# EAGLE design hf-upconverter (EAGLE 7.4.0)
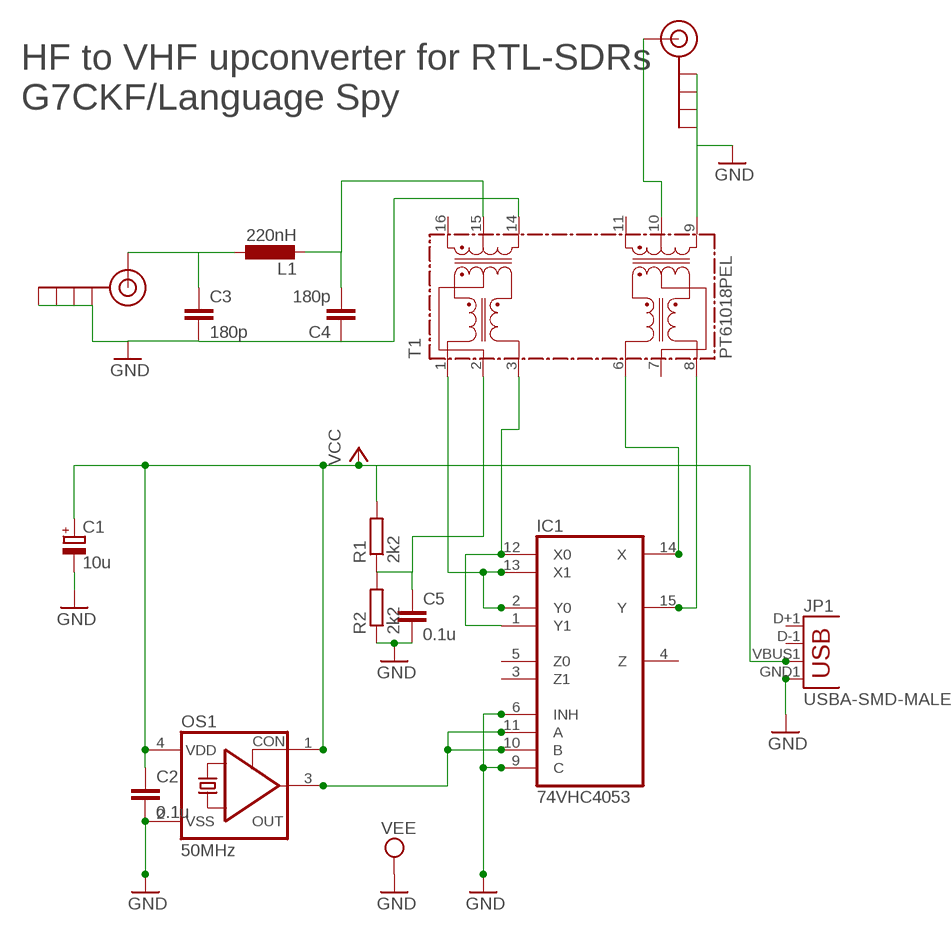
[diagram p0: schematic, sheet 1]

## Parts
C1  10u  CPOL-EUB  [PANASONIC_B]
C2  0.1u  C-EUC0805  [C0805]
C3  180p  C-EUC0805  [C0805]
C4  180p  C-EUC0805  [C0805]
C5  0.1u  C-EUC0805  [C0805]
IC1  74VHC4053  4053D  [SO16]
JP1  USBA-SMD-MALE  [USB-A-SMT-MALE]
L1  220nH  L-EU  [R1206]
OS1  50MHz  OSC-OE-CFPS-32  [7.2X5.2-4-PAD]
R1  2k2  R-EU_R0805  [R0805]
R2  2k2  R-EU_R0805  [R0805]
SMA1  ANT  SMA_EDGE  [SMA-EDGE]
SMA2  OUT  SMA_EDGE  [SMA-EDGE]
T1  PT61018PEL  TG110-E050N5  [N5]

## Nets
GND: C1.- C2.2 C3.2 C4.1 C5.2 IC1.6(INH) IC1.9(C) JP1.GND1(GND) OS1.2(VSS) R2.1 SMA1.GND@0(GND) SMA1.GND@1(GND) SMA1.GND@2(GND) SMA1.GND@3(GND) SMA2.GND@0(GND) SMA2.GND@1(GND) SMA2.GND@2(GND) SMA2.GND@3(GND) T1.9 T1.14 ; supply symbol labelled VEE
N$1: IC1.10(B) IC1.11(A) OS1.3(OUT)
N$2: C5.1 R1.1 R2.2 T1.2
N$3: IC1.1(Y1) IC1.12(X0) T1.3
N$4: IC1.2(Y0) IC1.13(X1) T1.1
N$5: C3.1 L1.1 SMA1.SIG(SIGNAL)
N$8: IC1.14(X) T1.6
N$9: IC1.15(Y) T1.8
N$10: C4.2 L1.2 T1.15
N$14: SMA2.SIG(SIGNAL) T1.10
VCC: C1.+ C2.1 JP1.VBUS1(VBUS) OS1.1(CON) OS1.4(VDD) R1.2
Unconnected: IC1.3(Z1) IC1.4(Z) IC1.5(Z0) JP1.D+1(D+) JP1.D-1(D-) T1.7 T1.11 T1.16

## Notes on the sheet
- HF to VHF upconverter for RTL-SDRs
  G7CKF/Language Spy

## Power pins joined to a net without a drawn wire
GND: IC1.7(VEE) IC1.8(GND)
VCC: IC1.16(VCC)

## Library data of the parts
C1 = rcl:CPOL-EU: POLARIZED CAPACITOR, European symbol
C2-C5 = rcl:C-EU: CAPACITOR, European symbol
IC1 = 40xx:4053: Triple 2-channel ANALOG MULTIPLEXER
JP1 = SparkFun-Connectors:USB: USB Connectors USB-B-PTH is fully proven SKU : PRT-00139/CONN-08278 USB-miniB is fully proven SKU : PRT-00587 USB-A-PCB is untested. USB-A-H is throughly reviewed, but untested. Spark Fun Electronics SKU : PRT-00437 USB-B-SMT is throughly reviewed, but untested. Needs silkscreen touching up. USB-A-S has not been used/tested USB-MB-H has not been used/tested USB-MICROB has been used. CONN-09505
L1 = L1206:L-EU: INDUCTOR, European symbol
OS1 = IQD-Frequency-Products:OSC-OE: OSCILLATOR WITH OE
R1 R2 = rcl:R-EU_: RESISTOR, European symbol
SMA1 SMA2 = SparkFun-Connectors:SMA_EDGE: SMA Antenna Connector End launch SMA connector. The paste layer has been removed so that the connector can be hand soldered onto the board after reflow.
T1 = halo-electronics:TG110-E050N5: E-Ultra (TM) 10/100BASE-TX SOIC-16 Fast Ethernet Magnetic Modules Source: www.haloelectronics.com .. e-ultra.pdf

## Board
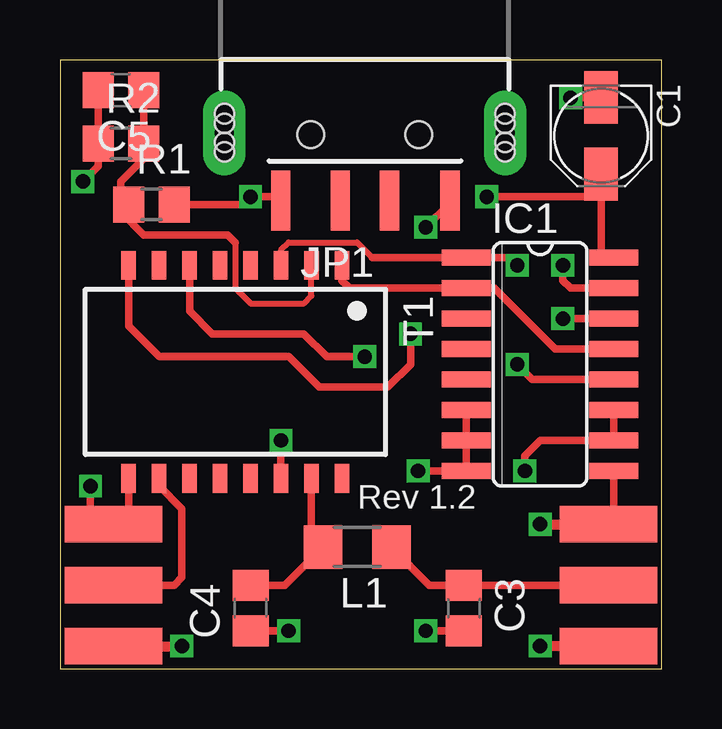
[diagram p1: board, top side]
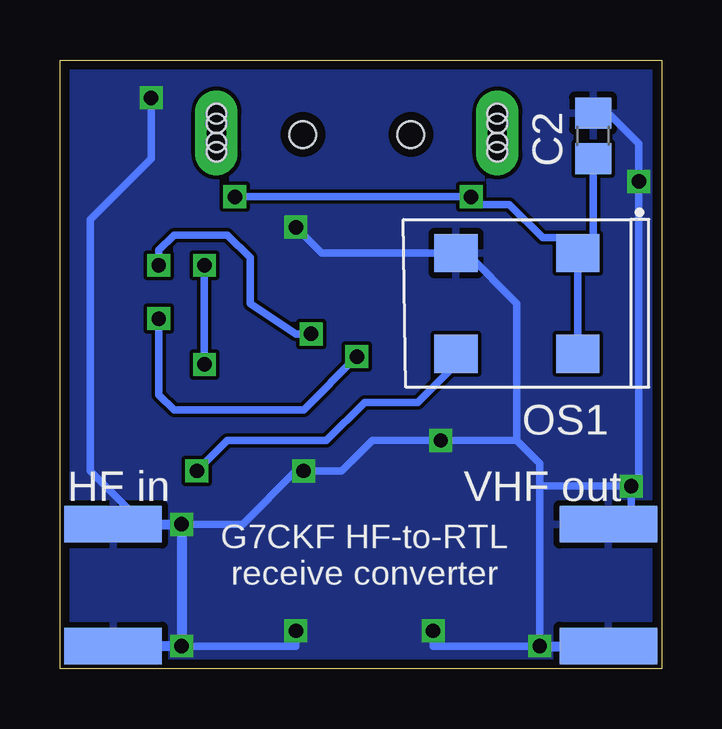
[diagram p2: board, bottom side, seen from below]

Size 25.07 x 25.39 mm. Coordinates in mm from the lower left corner, seen from the top.
Outline: 0,0 25.07,0 25.07,25.39 0,25.39 0,0
Copper layers (1*16): Top 0.0356mm / dielectric 1.5011mm / Bottom 0.0356mm
Design rules "LaenPCBOrder": minimum track width 6mil, minimum drill 13mil, track to track 6mil, track to pad 6mil, pad to pad 6mil, via to via 6mil, smd to smd 6mil, copper to edge 15mil, drill to drill 6mil, minimum pad ring 7mil, minimum via ring 7mil, stop-mask expansion 3mil, vias tented up to drill 0mil, thermal gap 10mil

### Footprints (pad centres in the part's own frame; a part is rotated, then mirrored left to right if it is on the bottom)
PANASONIC_B = smd 2.2 x 1.4: + 1.6,0; - -1.6,0
C0805 = smd 1.3 x 1.5: 1 -0.95,0; 2 0.95,0
SO16 = smd 0.66 x 2.032: 1 -4.445,-3.073; 2 -3.175,-3.073; 3 -1.905,-3.073; 4 -0.635,-3.073; 5 0.635,-3.073; 6 1.905,-3.073; 7 3.175,-3.073; 8 4.445,-3.073; 9 4.445,3.073; 10 3.175,3.073; 11 1.905,3.073; 12 0.635,3.073; 13 -0.635,3.073; 14 -1.905,3.073; 15 -3.175,3.073; 16 -4.445,3.073
USB-A-SMT-MALE = smd 0.8 x 2.5: D+1 1.027,-5.87; D-1 -1.027,-5.87; GND1 3.551,-5.87; VBUS1 -3.5,-5.87 | drill 0.8 pad 1.778 long: P$1 5.85,-3.05; P$3 -5.85,-3.05 | hole 1.1: 2.25,-3.12; -2.25,-3.12 | hole 0.8: -5.85,-3.45; -5.85,-3.85; -5.85,-2.65; -5.85,-2.25; 5.85,-3.45; 5.85,-3.85; 5.85,-2.65; 5.85,-2.25
R1206 = smd 1.6 x 1.803: 1 -1.422,0; 2 1.422,0
7.2X5.2-4-PAD = smd 1.8 x 1.6: 1 -2.54,-2.1; 2 2.54,-2.1; 3 2.54,2.1; 4 -2.54,2.1
R0805 = smd 1.3 x 1.5: 1 -0.95,0; 2 0.95,0
SMA-EDGE = smd 1.524 x 4.064: GND@0 0,0; GND@1 5.08,0; SIG 2.54,0 | smd 1.524 x 4.064 bottom: GND@2 0,0; GND@3 5.08,0
N5 = smd 0.6 x 1.2: 1 -4.445,-4.445; 2 -3.175,-4.445; 3 -1.905,-4.445; 4 -0.635,-4.445; 5 0.635,-4.445; 6 1.905,-4.445; 7 3.175,-4.445; 8 4.445,-4.445; 9 4.445,4.445; 10 3.175,4.445; 11 1.905,4.445; 12 0.635,4.445; 13 -0.635,4.445; 14 -1.905,4.445; 15 -3.175,4.445; 16 -4.445,4.445

### Placement (x,y rotation side)
C1  22.54,22.23 270 top
C2  2.86,22.23 90 bottom
C3  16.83,2.54 270 top
C4  7.94,2.54 90 top
C5  2.54,24.13 180 top
IC1  20,12.7 270 top
JP1  12.7,25.4 0 top
L1  12.38,5.08 180 top
OS1  6.03,15.24 180 bottom
R1  3.81,19.37 0 top
R2  2.54,21.91 0 top
SMA1  22.86,0.95 90 top
SMA2  2.22,0.95 90 top
T1  7.3,12.38 180 top

### Tracks (layer width: path | path; a pad name or v marks a point on that pad's centre or on a via)
GND  (via drill 0.6)
  Top 0.305: IC1.6 IC1.7 IC1.8 v14.92,8.26 | SMA1.GND@1 23.08,6.03 IC1.9 | T1.14 v9.21,9.53 | v1.27,7.62 1.27,6.03 SMA2.GND@3 2.86,6.67 T1.9 | C4.1 v9.52,1.59 v9.53,1.59 | C3.2 v15.24,1.59 | JP1.GND1 16.25,19.43 v15.24,18.41 | v21.27,23.81 22.53,23.81 C1.- | v0.95,20.32 1.59,20.96 R2.1 C5.2
  Top 0.406: SMA2.GND@2 v5.08,0.95 | v20,6.03 SMA1.GND@1 | SMA1.GND@2 v20,0.95
  Bottom 0.305: v20,6.03 17.46,6.03 15.24,8.26 v14.92,8.26 13.34,8.26 12.06,9.53 v9.21,9.53 6.03,9.53 | v1.27,7.62 5.08,7.62 | 5.08,7.62 v5.08,0.95 9.53,0.95 v9.53,1.59 | v1.27,7.62 1.27,6.03 SMA2.GND@3 | 5.08,7.62 5.08,8.57 6.03,9.53 | v15.24,1.59 15.24,0.95 v20,0.95 | v15.24,18.41 14.16,17.34 OS1.2 8.13,17.34 6.03,15.24 6.03,9.53 | v21.27,23.81 21.27,21.27 23.81,18.73 23.81,8.26 21.59,6.03 | C2.2 2.22,23.18 0.95,21.91 v0.95,20.32 0.95,7.94 v1.27,7.62
  Bottom 0.406: v5.08,0.95 SMA2.GND@2 | SMA1.GND@1 21.59,6.03 v20,6.03 v20,0.95 SMA1.GND@2
  pour Bottom: 0,25.4 25.08,25.4 25.08,0 0,0
N$1  (via drill 0.6)
  Top 0.305: IC1.11 IC1.10 20,9.53 19.37,8.89 v19.37,8.26
  Bottom 0.305: OS1.3 8.26,13.02 10.16,11.11 12.38,11.11 13.97,9.53 18.1,9.53 v19.37,8.26
N$2
  Top 0.254: 7.3,17.78 7.3,15.88 7.94,15.24 10.16,15.24 10.48,15.56 T1.2
  Top 0.305: 7.3,17.78 6.99,18.1 3.49,18.1 2.54,19.05 R1.1 2.54,19.37 2.54,20.32 3.49,21.27 R2.2 C5.1
N$3  (via drill 0.6)
  Top 0.254: 13.02,17.14 12.38,17.78 9.53,17.78 9.21,17.46 T1.3
  Top 0.305: 13.02,17.14 IC1.1 18.73,17.14 v19.05,16.83 | IC1.12 19.68,12.06 v19.05,12.7
  Bottom 0.305: v19.05,12.7 v19.05,16.83
N$4
  Top 0.305: IC1.13 20.64,13.34 18.1,15.88 IC1.2 12.06,15.88 11.75,16.19 T1.1
N$5
  Top 0.305: L1.1 15.39,3.49 C3.1 SMA1.SIG
N$8  (via drill 0.6)
  Top 0.305: IC1.14 v20.95,14.61 | v12.7,13.02 11.11,13.02 10.16,13.97 6.35,13.97 5.4,14.92 T1.6
  Bottom 0.305: v20.95,14.61 20.95,11.43 20.32,10.79 14.92,10.79 v12.7,13.02
N$9  (via drill 0.6)
  Top 0.305: T1.8 2.86,14.29 4.13,13.02 9.53,13.02 10.79,11.75 13.65,11.75 14.61,12.7 v14.61,13.97 | v20.95,16.83 20.95,16.19 21.27,15.88 IC1.15
  Bottom 0.305: v20.95,16.83 20.95,17.46 20.32,18.1 18.1,18.1 17.14,17.14 17.14,15.24 15.24,13.97 v14.61,13.97
N$10
  Top 0.305: C4.2 9.37,3.49 L1.2 10.48,5.56 T1.15
N$14
  Top 0.305: SMA2.SIG 4.76,3.49 5.08,3.81 5.08,6.67 4.13,7.62 T1.10
VCC  (via drill 0.6)
  Top 0.305: JP1.VBUS1 9.21,19.68 v7.94,19.68 7.62,19.37 R1.2 | 22.54,19.68 v17.78,19.68 | 22.54,19.68 22.54,17.14 IC1.16 | C1.+ 22.54,19.68
  Bottom 0.305: OS1.4 3.49,14.92 | 3.49,14.92 OS1.1 2.86,17.98 | 3.5,15.24 3.49,14.92 | v17.78,19.68 v7.94,19.68 7.62,19.37 6.35,19.37 4.96,17.98 2.86,17.98 | C2.1 2.86,17.98

### Text on the board
tNames: Rev 1.2
bNames: VHF out | HF in | G7CKF HF-to-RTL / receive converter